# Altium schematic sheet Top_level_20111.SchDoc
size A4; DrawnBy: Mike Cusdin; Organization: University of Canterbury; Address1: Electrical & Computer Eng; Address2: Private Bag 4800; Address3: Christchurch 8020; Address4: New Zealand; Revision: 2.0
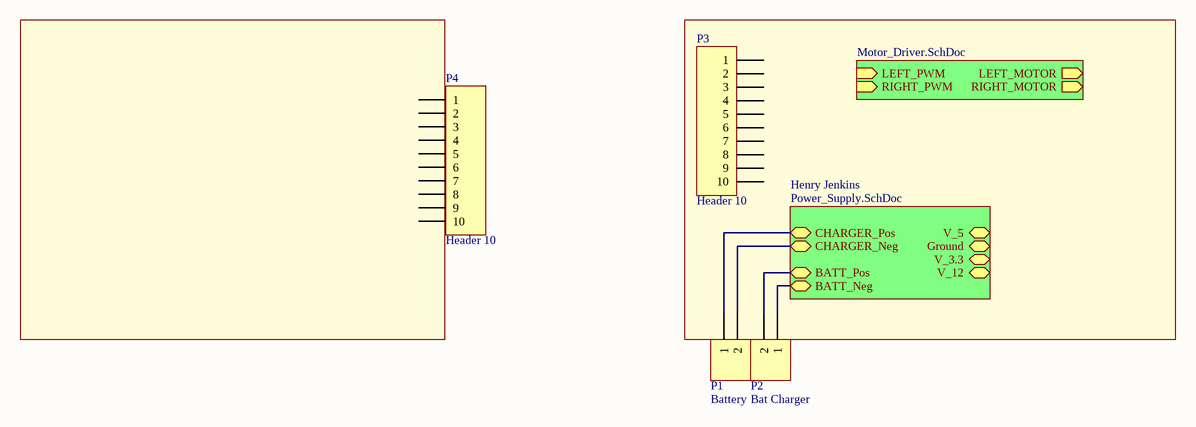
[diagram p0: Top_level_20111.SchDoc]

## Parts
P1  Battery  [TMHDR2]
P2  Bat Charger  [DC1.6]
P3  Header 10  [HDR1X10]
P4  Header 10  [HDR1X10]

## Sub-sheets
Henry Jenkins = Power_Supply.SchDoc: BATT_Pos, CHARGER_Neg, CHARGER_Pos, BATT_Neg, V_5, Ground, V_3.3, V_12
? = Motor_Driver.SchDoc: LEFT_PWM (in), RIGHT_PWM (in), LEFT_MOTOR (out), RIGHT_MOTOR (out)

## Nets
NetP1_1: P1.1 ; sheet Henry Jenkins/CHARGER_Pos
NetP1_2: P1.2 ; sheet Henry Jenkins/CHARGER_Neg
NetP2_1: P2.1 ; sheet Henry Jenkins/BATT_Neg
NetP2_2: P2.2 ; sheet Henry Jenkins/BATT_Pos

Not connected (* = marked no-connect by the designer): P3 1 2 3 4 5 6 7 8 9 10; P4 1 2 3 4 5 6 7 8 9 10

## Notes on the sheet
- Title
- Size:
- Date:
- A4
- Number:
- Time:
- Revision:
- Sheet
- of
- File:

## Library data of the parts
P1 = MHDR1X2: Header, 2-Pin; LatestRevisionDate: 17-Jul-2002; LatestRevisionNote: Re-released for DXP Platform.; Publisher: Altium Limited
P2 = Header 2: Header, 2-Pin; LatestRevisionDate: 17-Jul-2002; LatestRevisionNote: Re-released for DXP Platform.; Publisher: Altium Limited
P3 P4 = Header 10: Header, 10-Pin; LatestRevisionDate: 17-Jul-2002; LatestRevisionNote: Re-released for DXP Platform.; Publisher: Altium Limited